# EAGLE schematic Tiny2 (EAGLE 8.0.1)
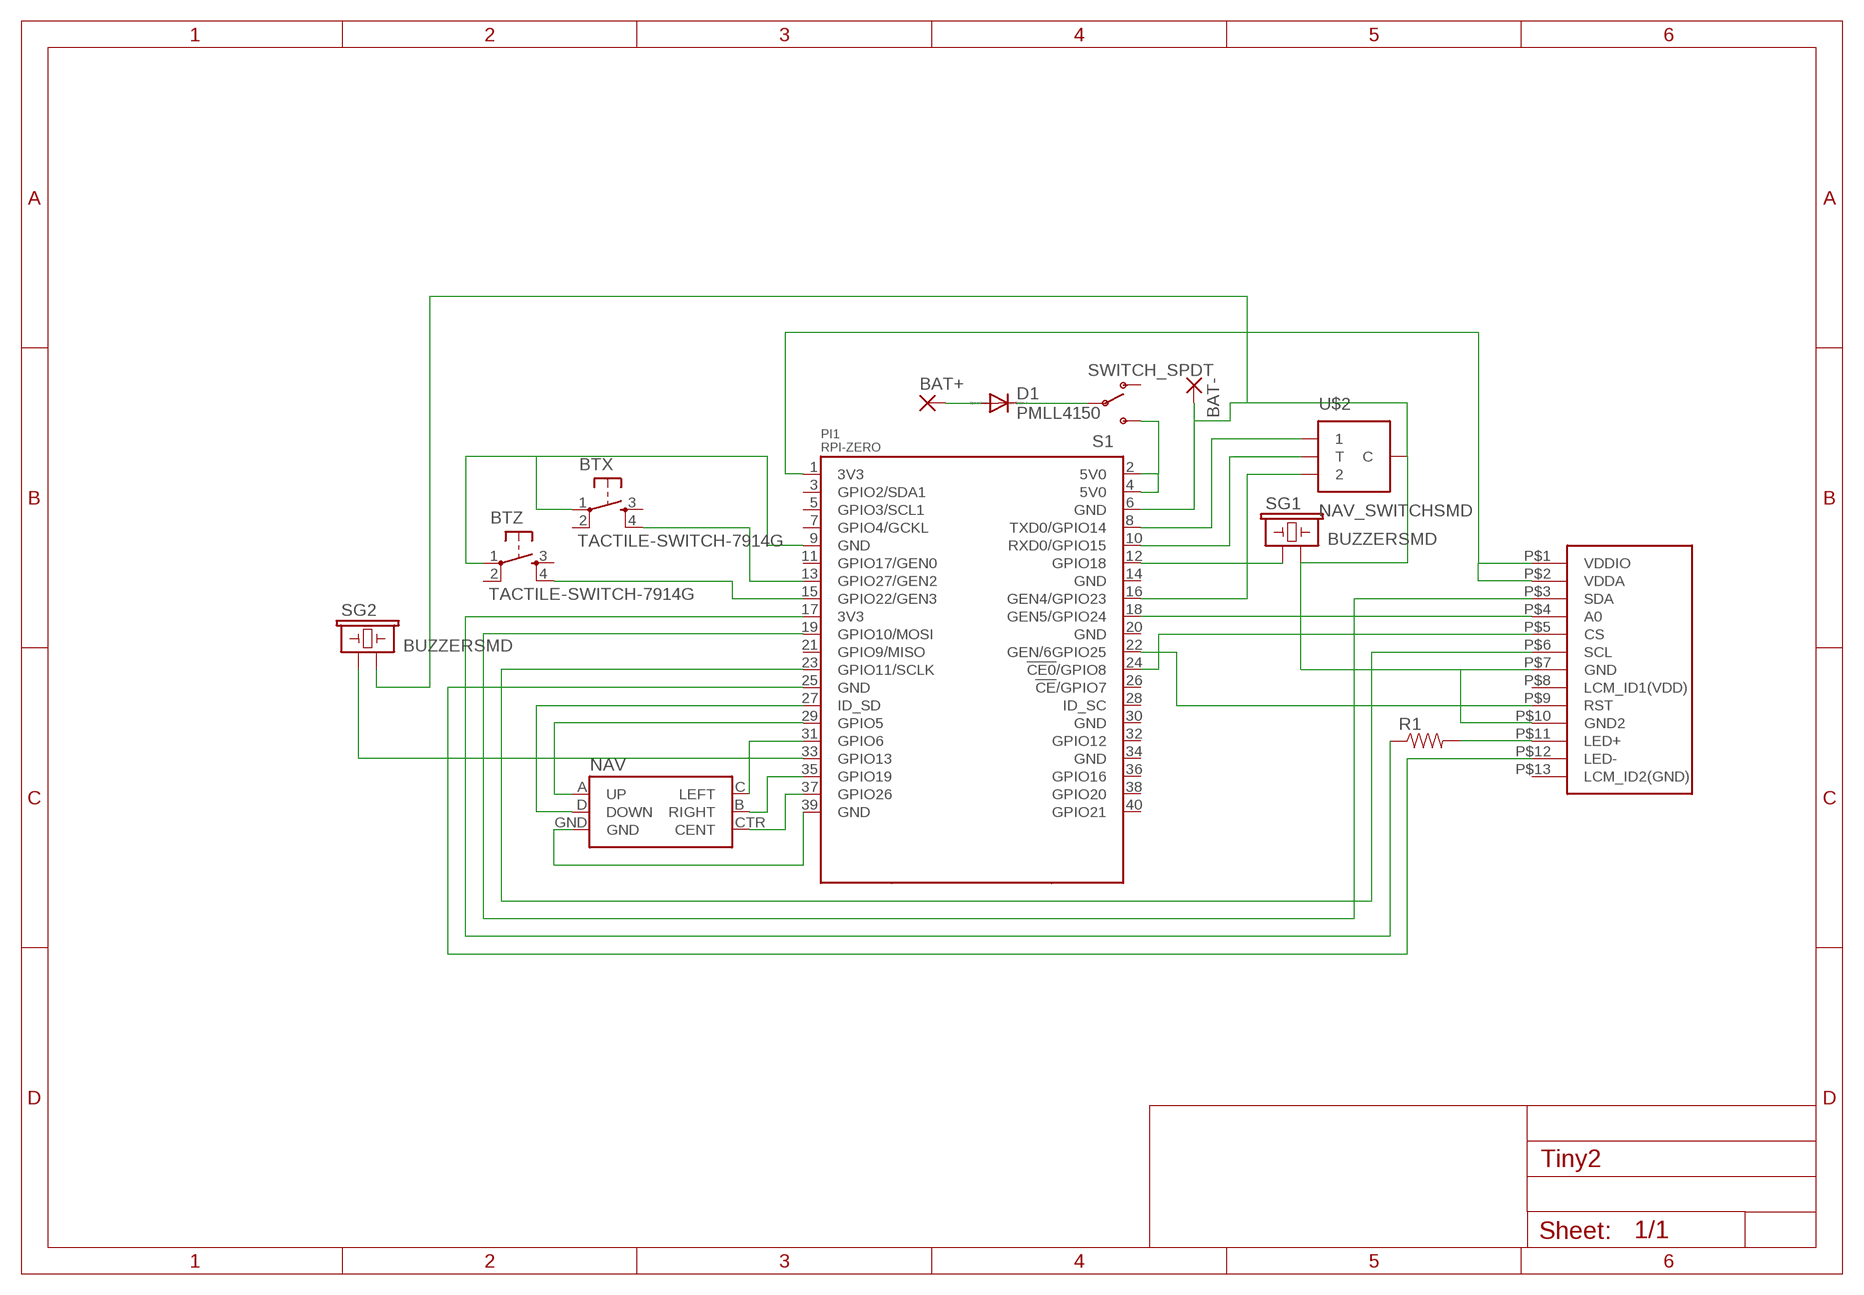
[diagram p0: schematic, sheet 1]

## Parts
BAT+  SMD5  [SMD2,54-5,08]
BAT-  SMD5  [SMD2,54-5,08]
BTX  TACTILE-SWITCH-7914G  [7914G]
BTZ  TACTILE-SWITCH-7914G  [7914G]
D1  PMLL4150  [SOD80C]
NAV  JOYSTICK_MINI  [JOYSTICK_MINI]
PI1  RPI-ZERO  [RASPBERRYPI_BASTELSTUBE_V13_RASPI_BOARD_B+_FULL]
R1  RESISTOR0805-RES  [0805]
S1  SWITCH_SPDT  [KPS-1290]
SG1  BUZZERSMD  [BUZZER-CMT1603]
SG2  BUZZERSMD  [BUZZER-CMT1603]
U$1  ST7735S-1.44  [ST7735S-1.44]
U$2  NAV_SWITCHSMD  [NAV_SWITCH]

## Nets
3V3@1: PI1.1(3V3) U$1.P$1(VDDIO) U$1.P$2(VDDA)
3V3@2: PI1.17(3V3) R1.1
5V0@2: PI1.2(5V0) PI1.4(5V0) S1.S
GND@1: BTX.1 BTZ.1 PI1.9(GND)
GND@2: PI1.25(GND) U$1.P$12(LED-)
GND@3: NAV.GND PI1.39(GND)
GND@8: BAT-.1(P) PI1.6(GND) SG1.P$2 SG2.P$2 U$1.P$7(GND) U$1.P$10(GND2) U$2.C
N$1: PI1.22(GEN/6GPIO25) U$1.P$9(RST)
N$2: PI1.23(GPIO11/SCLK) U$1.P$6(SCL)
N$3: PI1.19(GPIO10/MOSI) U$1.P$3(SDA)
N$4: NAV.CTR(CENT) PI1.37(GPIO26)
N$5: NAV.B(RIGHT) PI1.35(GPIO19)
N$6: PI1.18(GEN5/GPIO24) U$1.P$4(A0)
N$7: PI1.24(!CE0!/GPIO8) U$1.P$5(CS)
N$8: NAV.C(LEFT) PI1.31(GPIO6)
N$9: NAV.A(UP) PI1.29(GPIO5)
N$10: NAV.D(DOWN) PI1.27(ID_SD)
N$11: BTZ.4 PI1.15(GPIO22/GEN3)
N$12: BTX.4 PI1.13(GPIO27/GEN2)
N$13: PI1.12(GPIO18) SG1.P$1
N$14: R1.2 U$1.P$11(LED+)
N$15: PI1.33(GPIO13) SG2.P$1
N$16: PI1.8(TXD0/GPIO14) U$2.1
N$17: PI1.10(RXD0/GPIO15) U$2.T
N$18: PI1.16(GEN4/GPIO23) U$2.2
N$20: BAT+.1(P) D1.A
N$21: D1.C S1.P
Unconnected: BTX.2 BTX.3 BTZ.2 BTZ.3 PI1.3(GPIO2/SDA1) PI1.5(GPIO3/SCL1) PI1.7(GPIO4/GCKL) PI1.11(GPIO17/GEN0) PI1.14(GND) PI1.20(GND) PI1.21(GPIO9/MISO) PI1.26(!CE!/GPIO7) PI1.28(ID_SC) PI1.30(GND) PI1.32(GPIO12) PI1.34(GND) PI1.36(GPIO16) PI1.38(GPIO20) PI1.40(GPIO21) S1.O U$1.P$8(LCM_ID1(VDD)) U$1.P$13(LCM_ID2(GND))

## Library data of the parts
BAT+ BAT- = wirepad:SMD5: SMD PAD
BTX BTZ = GeekAmmo:TACTILE-SWITCH: Tactile Switch 4 Pins, SPST NO
D1 = diode:PMLL4150: DIODE high speed
NAV = SparkFun-Electromechanical:JOYSTICK_MINI: Small 5-way tactile joystick, COM-10063 4UCON SF303GJ26; PROD_ID: SWCH-09905
PI1 = RPI-Zero:RPI-ZERO
R1 = SparkFun-Resistors:RESISTOR: Resistor Basic schematic elements and footprints for 0603, 1206, and PTH resistors.
S1 = SparkFun-Electromechanical:SWITCH_SPDT: SWCH-10651 Side-actuated SPDT slide switch, as used on the Arduino Pro; PROD_ID: SWCH-10651
SG1 SG2 = SparkFun-Electromechanical:BUZZER: Buzzer 12mm Spark Fun Electronics SKU : Comp-Buzzer
U$1 = ST7735S:ST7735S-1.44
U$2 = SparkFun-Electromechanical:NAV_SWITCH: Navigation Switch Three way navigation switch. Commonly used as up/down/select on MP3 players. Schematic element and footprint production proven. Spark Fun Electronics SKU : COM-08184; PROD_ID: SWCH-08301